# Altium schematic sheet Sheet_BEEE.SchDoc: =DocumentName
size A4; Organization: Polytech; Address4: FRANCE; DocumentNumber: 1; SheetNumber: 1; SheetTotal: 1; Size: A4; SPICEModelCacheGWURXRYI: <root> / <DocumentId>GWURXRYI</DocumentId> / </root>
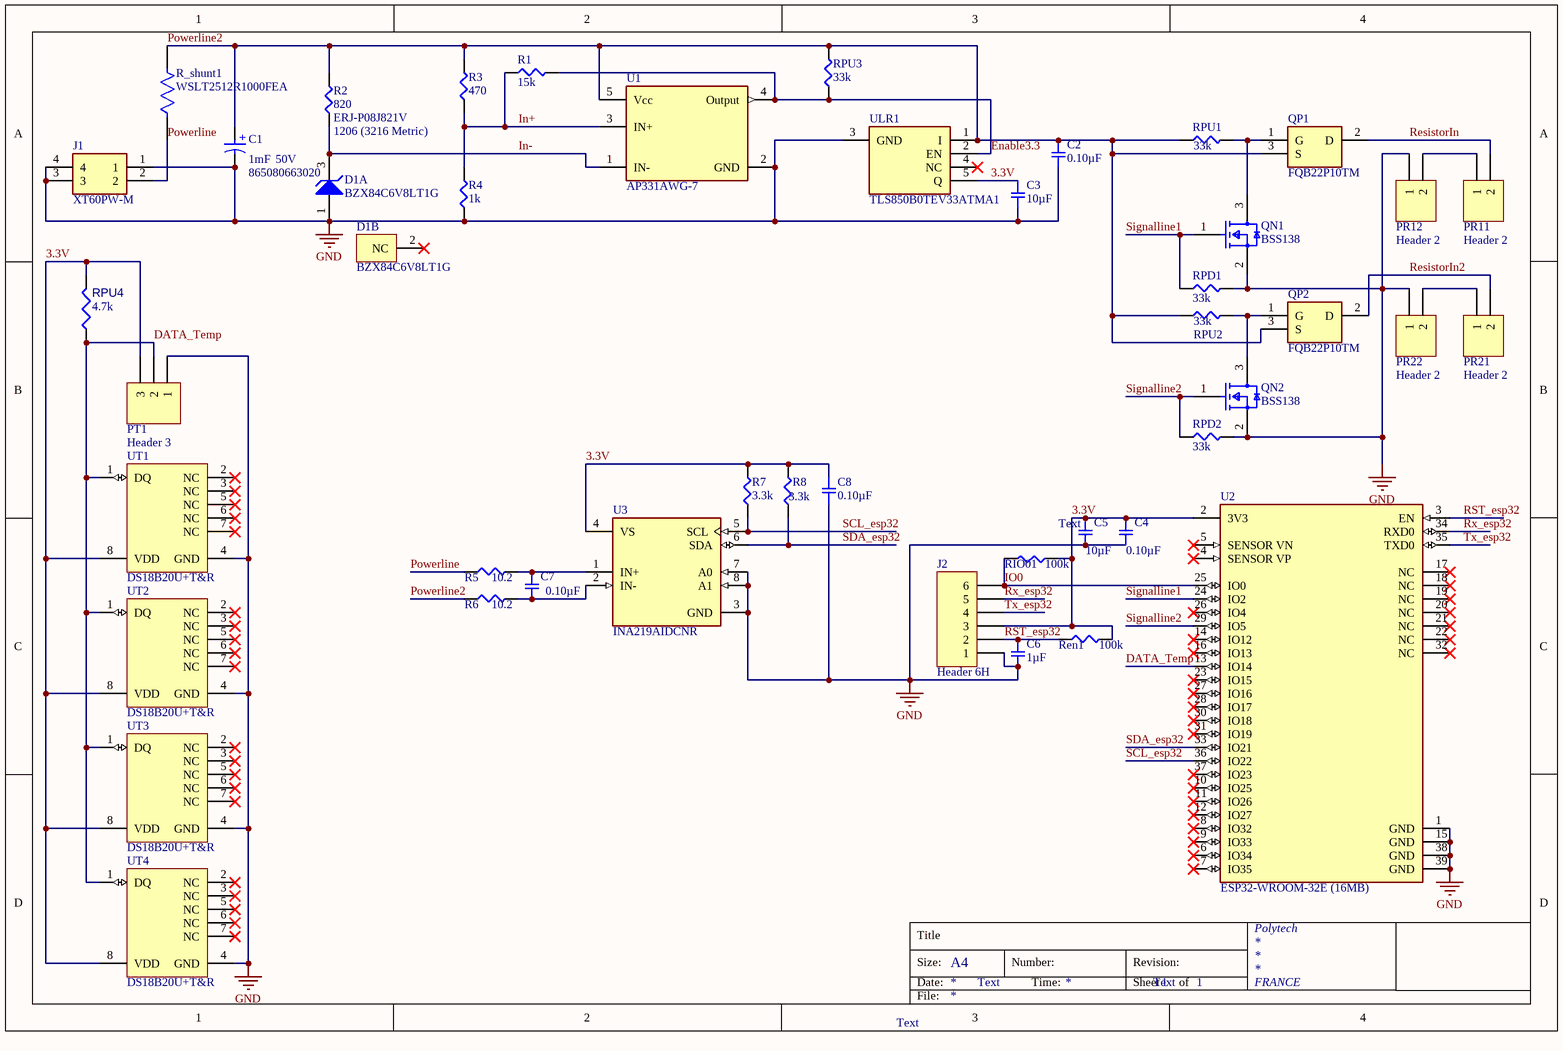
[diagram p0: Sheet_BEEE.SchDoc]

## Parts
C1  865080663020  Capacitance: 1mF  Voltage Rating: 50V  [WCAP-ASLI_D16H17]
C2  value 0.10µF  [SMD-0805C]  (hidden comment: GCM21BR71H104KA37K)
C3  value 10µF  [SMD-0805C]  (hidden comment: GRM21BR6YA106ME43L)
C4  value 0.10µF  [SMD-0805C]  (hidden comment: GCM21BR71H104KA37K)
C5  value 10µF  [SMD-0805C]  (hidden comment: GRM21BR6YA106ME43L)
C6  value 1µF  [SMD-0805C]  (hidden comment: GRJ21BR71H105KE01L)
C7  value 0.10µF  [SMD-0805C]  (hidden comment: GCM21BR71H104KA37K)
C8  value 0.10µF  [SMD-0805C]  (hidden comment: GCM21BR71H104KA37K)
D1  BZX84C6V8LT1G  [ONSC-SOT-23-3-318-08_V]  (parts A,B of 2)
J1  XT60PW-M  [XT60PWM]
J2  Header 6H  [HDR1X6H]
PR11  Header 2  [HDR1X2]
PR12  Header 2  [HDR1X2]
PR21  Header 2  [HDR1X2]
PR22  Header 2  [HDR1X2]
PT1  Header 3  [HDR1X3]
QN1  BSS138  [FP-318-08-IPC_B]
QN2  BSS138  [FP-318-08-IPC_B]
QP1  FQB22P10TM  [FQB22P10TM]
QP2  FQB22P10TM  [FQB22P10TM]
R1  value 15k  [SMD-1206-RES]  (hidden comment: ERJ-P08J153V)
R2  value 820  Package / Case: 1206 (3216 Metric)  [SMD-1206-RES]  (hidden comment: ERJ-P08J821V)
R3  value 470  [SMD-1206-RES]  (hidden comment: ERJ-8ENF4700V)
R4  value 1k  [SMD-1206-RES]  (hidden comment: ERJ-P08J102V)
R5  value 10.2  [SMD-1206-RES]  (hidden comment: ERJ-8ENF10R2V)
R6  value 10.2  [SMD-1206-RES]  (hidden comment: ERJ-8ENF10R2V)
R7  value 3.3k  [SMD-1206-RES]  (hidden comment: ERJ-8GEYJ332V)
R8  value 3.3k  [SMD-1206-RES]  (hidden comment: ERJ-8GEYJ332V)
R_shunt1  WSLT2512R1000FEA  [FP-WSLT2512-MFG]
Ren1  value 100k  [SMD-1206-RES]  (hidden comment: ERJ-P08J104V)
RIO01  value 100k  [SMD-1206-RES]  (hidden comment: ERJ-P08J104V)
RPD1  value 33k  [SMD-1206-RES]  (hidden comment: ERJ-P08J333V)
RPD2  value 33k  [SMD-1206-RES]  (hidden comment: ERJ-P08J333V)
RPU1  value 33k  [SMD-1206-RES]  (hidden comment: ERJ-P08J333V)
RPU2  value 33k  [SMD-1206-RES]  (hidden comment: ERJ-P08J333V)
RPU3  value 33k  [SMD-1206-RES]  (hidden comment: ERJ-P08J333V)
RPU4  value 4.7k  [RESC3116X70X50ML13T20]  (hidden comment: Resistor 4k7 +/-1% 1206 250 mW)
U1  AP331AWG-7  [FP-SOT25-MFG]
U2  ESP32-WROOM-32E (16MB)  [FP-ESP32-WROOM-32E_16MB-MFG]
U3  INA219AIDCNR  [FP-DCN0008A-IPC_B]
ULR1  TLS850B0TEV33ATMA1  [BTS6143D]
UT1  DS18B20U+T&R  [MAXM-U8+1_M]
UT2  DS18B20U+T&R  [MAXM-U8+1_M]
UT3  DS18B20U+T&R  [MAXM-U8+1_M]
UT4  DS18B20U+T&R  [MAXM-U8+1_M]

## Nets
GND: C1.2(N) C2.2 C3.2 C4.2 C5.2 C6.2 C8.1 D1.1(A) J1.1 J1.3 J1.4 J2.1 PR12.1 PR22.1 PT1.1 QN1.2(S) QN2.2(S) R4.1 RPD1.2 RPD2.2 U1.2(GND) U2.1(GND) U2.15(GND) U2.38(GND) U2.39(GND) U3.3(GND) U3.7(A0) U3.8(A1) ULR1.3(GND) UT1.4(GND) UT2.4(GND) UT3.4(GND) UT4.4(GND)
3.3V: C3.1 C4.1 C5.1 C8.2 J2.3 PT1.3 R7.2 R8.2 Ren1.2 RIO01.1 RPU4.2 U2.2(3V3) U3.4(VS) ULR1.5(Q) UT1.8(VDD) UT2.8(VDD) UT3.8(VDD) UT4.8(VDD)
DATA_Temp: PT1.2 RPU4.1 U2.13(IO14) UT1.1(DQ) UT2.1(DQ) UT3.1(DQ) UT4.1(DQ)
Enable3.3: R1.2 RPU3.1 U1.4(Output) ULR1.2(EN)
In+: R1.1 R3.1 R4.2 U1.3(IN+)
In-: D1.3(K) R2.1 U1.1(IN-)
IO0: J2.6 RIO01.2 U2.25(IO0)
Powerline: J1.2 R5.1 R_shunt1.1
Powerline2: C1.1(P) C2.1 QP1.3(S) QP2.3(S) R2.2 R3.2 R6.1 R_shunt1.2 RPU1.1 RPU2.1 RPU3.2 U1.5(Vcc) ULR1.1(I)
ResistorIn: PR11.2 QP1.2(D)
ResistorIn2: PR21.2 QP2.2(D)
RST_esp32: C6.1 J2.2 Ren1.1 U2.3(EN)
Rx_esp32: J2.5 U2.34(RXD0)
SCL_esp32: R7.1 U2.36(IO22) U3.5(SCL)
SDA_esp32: R8.1 U2.33(IO21) U3.6(SDA)
Signalline1: QN1.1(G) RPD1.1 U2.24(IO2)
Signalline2: QN2.1(G) RPD2.1 U2.29(IO5)
Tx_esp32: J2.4 U2.35(TXD0)
NetC7_1: C7.1 R5.2 U3.1(IN+)
NetC7_2: C7.2 R6.2 U3.2(IN-)
NetPR11_1: PR11.1 PR12.2
NetPR21_1: PR21.1 PR22.2
NetQN1_3: QN1.3(D) QP1.1(G) RPU1.2
NetQN2_3: QN2.3(D) QP2.1(G) RPU2.2

Not connected (* = marked no-connect by the designer): D1 2(NC)*; U2 4(SENSOR_VP)* 5(SENSOR_VN)* 6(IO34)* 7(IO35)* 8(IO32)* 9(IO33)* 10(IO25)* 11(IO26)* 12(IO27)* 14(IO12)* 16(IO13)* 17(NC)* 18(NC)* 19(NC)* 20(NC)* 21(NC)* 22(NC)* 23(IO15)* 26(IO4)* 27(IO16)* 28(IO17)* 30(IO18)* 31(IO19)* 32(NC)* 37(IO23)*; ULR1 4(NC)*; UT1 2(NC)* 3(NC)* 5(NC)* 6(NC)* 7(NC)*; UT2 2(NC)* 3(NC)* 5(NC)* 6(NC)* 7(NC)*; UT3 2(NC)* 3(NC)* 5(NC)* 6(NC)* 7(NC)*; UT4 2(NC)* 3(NC)* 5(NC)* 6(NC)* 7(NC)*

## Notes on the sheet
- (near C5) Text
- Text
- Title
- Size:
- Date:
- A4
- Number:
- Time:
- Revision:
- Sheet
- of
- File:
- (in symbol CMP-03913-53914628-1) +

## Library data of the parts
C1 = CMP-03913-53914628-1: 865080663020 WCAP-ASLI Aluminum Electrolytic Capacitors; Ripple Current: 1A; Tolerance: 20%; Life (Hours): 2000hours; ESR (Equivalent Series Resistance): 60.8615mΩ; Leakage Current: 500µA; Insulation Resistance: 100kΩ; Impedance: 78mΩ; Polarity: Polar; RoHS: Compliant; NexarPartId: 53914628; Width: 17.1mm; Height: 17mm; Diameter: 16mm; Mount: Surface Mount; Min Operating Temperature: -55°C; Ripple Current (AC): 1A; Max Operating Temperature: 105°C; Voltage Rating (DC): 50V; REACH SVHC: Unknown; Length: 17mm; Case/Package: Radial; Packaging: Tape & Reel (TR); Height - Seated (Max): 16.9926mm
C2 C4 C7 C8 = CMP-026-000437-1: CAP CER 0.1UF 50V X7R 0805; Manufacturer: Murata Electronics North America; Minimum Quantity: 1; Unit Price (USD): 0.12; Factory Stock: 0; Tolerance: ±10%; Packaging: Cut Tape (CT); Size / Dimension: 0.079" L x 0.049" W (2.00mm x 1.25mm); Lead Style: -; Mounting Type: Surface Mount, MLCC; Operating Temperature: -55°C ~ 125°C; Image: //media.digikey.com/photos/Murata%20Photos/NCP,GCM%20SERIES%200805.jpg; Voltage: 50V; Datasheets: http://www.murata.com/~/media/webrenewal/support/library/catalog/products/capacitor/mlcc/c03e.ashx; Lead Spacing: -; Package / Case: 0805 (2012 Metric); Ratings: AEC-Q200; Features: -; Part Status: Active; Temperature Coefficient: X7R; Part Number: GCM21BR71H104KA37K; Digi-Key Part Number: 490-8049-1-ND; Thickness (Max): 0.055" (1.40mm); Applications: Automotive; Quantity Available: 322; @ qty: 0; Height - Seated (Max): -; Series: GCM
C3 C5 = CMP-026-000648-1: CAP CER 10UF 35V X5R 0805; Manufacturer: Murata Electronics North America; Factory Stock: 0; Unit Price (USD): 0.33; Tolerance: ±20%; Minimum Quantity: 1; Applications: General Purpose; Part Status: Active; Image: //media.digikey.com/Renders/Murata%20Renders/0805%20(2012%20Metric)%20.85mm.jpg; Quantity Available: 79139; Size / Dimension: 0.079" L x 0.049" W (2.00mm x 1.25mm); Datasheets: http://www.murata.com/~/media/webrenewal/support/library/catalog/products/capacitor/mlcc/c02e.pdf; Package / Case: 0805 (2012 Metric); Lead Style: -; Ratings: -; Digi-Key Part Number: 490-10515-1-ND; Height - Seated (Max): -; @ qty: 0; Lead Spacing: -; Part Number: GRM21BR6YA106ME43L; Features: Derating Recommended; Voltage: 35V; Temperature Coefficient: X5R; Operating Temperature: -55°C ~ 85°C; Mounting Type: Surface Mount, MLCC; Packaging: Cut Tape (CT); Thickness (Max): 0.057" (1.45mm); Series: GRM
C6 = CMP-026-000525-1: CAP CER 1UF 50V X7R 0805; Manufacturer: Murata Electronics North America; Factory Stock: 0; Unit Price (USD): 0.26; Tolerance: ±10%; Minimum Quantity: 1; Package / Case: 0805 (2012 Metric); Datasheets: http://www.murata.com/~/media/webrenewal/support/library/catalog/products/capacitor/mlcc/c02e.pdf; Operating Temperature: -55°C ~ 125°C; Size / Dimension: 0.079" L x 0.049" W (2.00mm x 1.25mm); Image: //media.digikey.com/Renders/Murata%20Renders/0805%20(2012%20Metric)%20.85mm.jpg; Packaging: Cut Tape (CT); Ratings: -; Digi-Key Part Number: 490-10924-1-ND; Quantity Available: 2092; Mounting Type: Surface Mount, MLCC; Height - Seated (Max): -; Series: GRJ; Part Number: GRJ21BR71H105KE01L; Thickness (Max): 0.057" (1.45mm); Applications: Boardflex Sensitive; Part Status: Active; Lead Spacing: -; Features: Soft Termination; Temperature Coefficient: X7R; Lead Style: -; Voltage: 50V; @ qty: 0
D1 = CMP-1060-00902-1: Zener Voltage Regulator, 225 mW, 3-Pin SOT-23, Pb-Free, Tape and Reel; Manufacturer: On Semiconductor; ComponentLink2Description: Datasheet; RoHS: Pb-Free; ComponentLink2URL: http://www.onsemi.com/pub_link/Collateral/BZX84C2V4LT1-D.PDF; ComponentLink1Description: Manufacturer URL; ComponentLink3URL: http://www.onsemi.cn/pub_link/Collateral/318-08.PDF; PartNumber: BZX84C6V8LT1G; ComponentLink1URL: http://www.onsemi.com/; Mounting Technology: Surface Mount; PackageDescription: 3-Pin Small Outline Transistor, Body 2.92 x 1.3 mm, Pitch 0.95 mm; Packing: Tape and Reel; ComponentLink3Description: Package Specification; PackageReference: SOT-23-3-318-08; PackageVersion: Rev. AP, 11/2009; DatasheetVersion: Rev. 17
J1 = XT60PW-M: Connector; Manufacturer_Name: Changzou Amass Elec; Datasheet Link: https://www.tme.eu/Document/9b8d0c5eb7094295f3d3112c214d3ade/XT60PW%20SPEC.pdf; Height: 8.4mm; Manufacturer_Part_Number: XT60PW-M
J2 = Header 6H: Header, 6-Pin, Right Angle; LatestRevisionDate: 17-Jul-2002; LatestRevisionNote: Re-released for DXP Platform.; Publisher: Altium Limited; Supplier 1: Rs; Supplier Part Number 1: 8281660
PR11 PR12 PR21 PR22 = Header 2: Header, 2-Pin; LatestRevisionDate: 17-Jul-2002; LatestRevisionNote: Re-released for DXP Platform.; Publisher: Altium Limited
PT1 = Header 3: Header, 3-Pin; LatestRevisionDate: 17-Jul-2002; LatestRevisionNote: Re-released for DXP Platform.; Publisher: Altium Limited
QN1 QN2 = CMP-07173-000101-1: MOSFET N-CH 50V 220MA SOT-23; Turn-Off Delay Time: 20ns; Element Configuration: Single; Rds On Max: 3.5R; Gate to Source Voltage (Vgs): 20V; Threshold Voltage: 1.3V; Number of Elements: 1; Power Dissipation: 360mW; Rise Time: 9ns; Turn-On Delay Time: 2.5ns; Input Capacitance: 27pF; On-State Resistance: 6R; Lead Free: Lead Free; Length: 2.92mm; Width: 1.3mm; Drain to Source Breakdown Voltage: 50V; Min Operating Temperature: -55°C; REACH SVHC: No SVHC; Packaging: Tape and Reel; Radiation Hardening: No; Height: 0.93mm; Drain to Source Voltage (Vdss): 50V; Current Rating: 220mA; Voltage Rating (DC): 50V; Weight: 0.03g; Continuous Drain Current (ID): 220mA; Number of Pins: 3; Nominal Vgs: 1.3V; Max Power Dissipation: 360mW; Fall Time: 9ns; Drain to Source Resistance: 3.5R; Contact Plating: Tin; Case/Package: SOT-23; Package Quantity: 1; Dual Supply Voltage: 50V; Mount: Surface Mount; Termination: SMD/SMT; Max Operating Temperature: 150°C
QP1 QP2 = FQB22P10TM: MOSFET (P-Channel); Manufacturer_Name: onsemi; Datasheet Link: https://www.onsemi.cn/download/data-sheet/pdf/fqb22p10-d.pdf; Height: 5.08mm; Manufacturer_Part_Number: FQB22P10TM; Mouser Part Number: 512-FQB22P10TM; Mouser Price/Stock: https://www.mouser.co.uk/ProductDetail/ON-Semiconductor-Fairchild/FQB22P10TM?qs=u3sZpSG73%252B7bL0dxrg7qrg%3D%3D; Arrow Part Number: FQB22P10TM; Arrow Price/Stock: https://www.arrow.com/en/products/fqb22p10tm/on-semiconductor?region=europe
R1 = CMP-015-001045-1: RES SMD 15K OHM 5% 2/3W 1206; Manufacturer: Panasonic Electronic Components; Factory Stock: 0; Temperature Coefficient: ±200ppm/°C; Minimum Quantity: 1; Power (Watts): 0.667W, 2/3W; Unit Price (USD): 0.02178; @ qty: 1500; Tolerance: ±5%; Supplier Device Package: 1206; Datasheets: https://industrial.panasonic.com/cdbs/www-data/pdf/RDA0000/AOA0000C243.pdf; Features: Automotive AEC-Q200, Pulse Withstanding; Failure Rate: -; Part Number: ERJ-P08J153V; Image: //media.digikey.com/Renders/Panasonic%20Renders/ERJ-1206%20Pkg.jpg; Part Status: Active; Height - Seated (Max): 0.028" (0.70mm); Composition: Thick Film; Quantity Available: 10955; Packaging: Cut Tape (CT); Number of Terminations: 2; Series: ERJ; Package / Case: 1206 (3216 Metric); Digi-Key Part Number: P15KALCT-ND; Operating Temperature: -55°C ~ 155°C; Size / Dimension: 0.126" L x 0.063" W (3.20mm x 1.60mm)
R2 = CMP-015-001133-1: RES SMD 820 OHM 5% 2/3W 1206; Manufacturer: Panasonic Electronic Components; Power (Watts): 0.667W, 2/3W; @ qty: 1500; Unit Price (USD): 0.02178; Temperature Coefficient: ±200ppm/°C; Factory Stock: 0; Minimum Quantity: 1; Operating Temperature: -55°C ~ 155°C; Part Status: Active; Digi-Key Part Number: P820ALCT-ND; Series: ERJ; Supplier Device Package: 1206; Features: Automotive AEC-Q200, Pulse Withstanding; Tolerance: ±5%; Failure Rate: -; Image: //media.digikey.com/Renders/Panasonic%20Renders/ERJ-1206%20Pkg.jpg; Quantity Available: 13581; Composition: Thick Film; Packaging: Cut Tape (CT); Size / Dimension: 0.126" L x 0.063" W (3.20mm x 1.60mm); Part Number: ERJ-P08J821V; Datasheets: https://industrial.panasonic.com/cdbs/www-data/pdf/RDA0000/AOA0000C243.pdf; Number of Terminations: 2; Height - Seated (Max): 0.028" (0.70mm)
R3 = CMP-015-000572-1: RES SMD 470 OHM 1% 1/4W 1206; Manufacturer: Panasonic Electronic Components; Power (Watts): 0.25W, 1/4W; Minimum Quantity: 1; Unit Price (USD): 0.00933; Factory Stock: 0; @ qty: 1500; Temperature Coefficient: ±100ppm/°C; Package / Case: 1206 (3216 Metric); Part Number: ERJ-8ENF4700V; Failure Rate: -; Size / Dimension: 0.126" L x 0.063" W (3.20mm x 1.60mm); Tolerance: ±1%; Part Status: Active; Datasheets: http://industrial.panasonic.com/www-cgi/jvcr13pz.cgi?E+PZ+3+AOA0002+ERJ8ENF4700V+7+WW; Image: //media.digikey.com/Renders/Panasonic%20Renders/ERJ-1206%20Pkg.jpg; Quantity Available: 55045; Packaging: Cut Tape (CT); Supplier Device Package: 1206; Series: ERJ; Operating Temperature: -55°C ~ 155°C; Features: Automotive AEC-Q200; Composition: Thick Film; Height - Seated (Max): 0.028" (0.70mm); Digi-Key Part Number: P470FCT-ND; Number of Terminations: 2
R4 = CMP-015-001023-1: RES SMD 1K OHM 5% 2/3W 1206; Manufacturer: Panasonic Electronic Components; Temperature Coefficient: ±200ppm/°C; Minimum Quantity: 1; Factory Stock: 0; Unit Price (USD): 0.02178; @ qty: 1500; Power (Watts): 0.667W, 2/3W; Tolerance: ±5%; Composition: Thick Film; Height - Seated (Max): 0.028" (0.70mm); Quantity Available: 85126; Supplier Device Package: 1206; Datasheets: https://industrial.panasonic.com/cdbs/www-data/pdf/RDA0000/AOA0000C243.pdf; Series: ERJ; Part Number: ERJ-P08J102V; Package / Case: 1206 (3216 Metric); Image: //media.digikey.com/Renders/Panasonic%20Renders/ERJ-1206%20Pkg.jpg; Failure Rate: -; Packaging: Cut Tape (CT); Features: Automotive AEC-Q200, Pulse Withstanding; Operating Temperature: -55°C ~ 155°C; Part Status: Active; Digi-Key Part Number: P1.0KALCT-ND; Number of Terminations: 2; Size / Dimension: 0.126" L x 0.063" W (3.20mm x 1.60mm)
R5 R6 = CMP-015-000202-1: RES SMD 10.2 OHM 1% 1/4W 1206; Manufacturer: Panasonic Electronic Components; Minimum Quantity: 1; Unit Price (USD): 0.00933; Power (Watts): 0.25W, 1/4W; Factory Stock: 0; Temperature Coefficient: ±100ppm/°C; @ qty: 1500; Supplier Device Package: 1206; Features: Automotive AEC-Q200; Operating Temperature: -55°C ~ 155°C; Packaging: Cut Tape (CT); Series: ERJ; Size / Dimension: 0.126" L x 0.063" W (3.20mm x 1.60mm); Failure Rate: -; Tolerance: ±1%; Height - Seated (Max): 0.028" (0.70mm); Part Number: ERJ-8ENF10R2V; Digi-Key Part Number: P10.2FCT-ND; Part Status: Active; Image: //media.digikey.com/Renders/Panasonic%20Renders/ERJ-1206%20Pkg.jpg; Package / Case: 1206 (3216 Metric); Composition: Thick Film; Quantity Available: 19753; Datasheets: http://industrial.panasonic.com/www-cgi/jvcr13pz.cgi?E+PZ+3+AOA0002+ERJ8ENF10R2V+7+WW; Number of Terminations: 2
R7 R8 = CMP-015-000849-1: RES SMD 3.3K OHM 5% 1/4W 1206; Manufacturer: Panasonic Electronic Components; Factory Stock: 0; @ qty: 1500; Unit Price (USD): 0.00700; Minimum Quantity: 1; Power (Watts): 0.25W, 1/4W; Temperature Coefficient: ±200ppm/°C; Failure Rate: -; Quantity Available: 426004; Height - Seated (Max): 0.028" (0.70mm); Package / Case: 1206 (3216 Metric); Number of Terminations: 2; Tolerance: ±5%; Image: //media.digikey.com/Renders/Panasonic%20Renders/ERJ-1206%20Pkg.jpg; Supplier Device Package: 1206; Datasheets: http://industrial.panasonic.com/www-cgi/jvcr13pz.cgi?E+PZ+3+AOA0001+ERJ8GEYJ332V+7+WW; Part Status: Active; Operating Temperature: -55°C ~ 155°C; Series: ERJ; Size / Dimension: 0.126" L x 0.063" W (3.20mm x 1.60mm); Digi-Key Part Number: P3.3KECT-ND; Packaging: Cut Tape (CT); Composition: Thick Film; Features: Automotive AEC-Q200; Part Number: ERJ-8GEYJ332V
R_shunt1 = CMP-00030-44432532-1: WSLT2512R1000FEA Res Metal Strip 2512 0.1 Ohm 1% 1W ±75ppm/C Pad SMD Automotive T/R; Resistance: 100mΩ; Temperature Coefficient: 75ppm/°C; REACH SVHC: Unknown; Height: 635µm; Power Rating: 1W; Case Code (Metric): 6432; Weight: 40.511469mg; Radiation Hardening: No; Mount: Surface Mount; Case/Package: 2512; Termination: SMD/SMT; Max Operating Temperature: 275°C; Width: 3.2mm; Min Operating Temperature: -65°C; Lead Free: Lead Free; Depth: 3.18mm; Schedule B: 8533210045, 8533210045; Composition: Metal Element, Metal Strip; Packaging: Cut Tape; Case Code (Imperial): 2512; NexarPartId: 44432532; Tolerance: 1%; RoHS: Compliant; Length: 6.3mm
Ren1 RIO01 = CMP-015-001025-1: RES SMD 100K OHM 5% 2/3W 1206; Manufacturer: Panasonic Electronic Components; Temperature Coefficient: ±200ppm/°C; @ qty: 1500; Power (Watts): 0.667W, 2/3W; Minimum Quantity: 1; Factory Stock: 0; Unit Price (USD): 0.02178; Digi-Key Part Number: P100KALCT-ND; Failure Rate: -; Number of Terminations: 2; Package / Case: 1206 (3216 Metric); Datasheets: https://industrial.panasonic.com/cdbs/www-data/pdf/RDA0000/AOA0000C243.pdf; Part Number: ERJ-P08J104V; Series: ERJ; Height - Seated (Max): 0.028" (0.70mm); Size / Dimension: 0.126" L x 0.063" W (3.20mm x 1.60mm); Tolerance: ±5%; Operating Temperature: -55°C ~ 155°C; Features: Automotive AEC-Q200, Pulse Withstanding; Supplier Device Package: 1206; Composition: Thick Film; Part Status: Active; Packaging: Cut Tape (CT); Image: //media.digikey.com/Renders/Panasonic%20Renders/ERJ-1206%20Pkg.jpg; Quantity Available: 9
RPD1 RPD2 RPU1-RPU3 = CMP-015-001084-1: RES SMD 33K OHM 5% 2/3W 1206; Manufacturer: Panasonic Electronic Components; Power (Watts): 0.667W, 2/3W; Factory Stock: 0; Minimum Quantity: 1; @ qty: 1500; Unit Price (USD): 0.02178; Temperature Coefficient: ±200ppm/°C; Quantity Available: 25960; Composition: Thick Film; Size / Dimension: 0.126" L x 0.063" W (3.20mm x 1.60mm); Series: ERJ; Package / Case: 1206 (3216 Metric); Tolerance: ±5%; Packaging: Cut Tape (CT); Failure Rate: -; Part Number: ERJ-P08J333V; Features: Automotive AEC-Q200, Pulse Withstanding; Supplier Device Package: 1206; Operating Temperature: -55°C ~ 155°C; Datasheets: https://industrial.panasonic.com/cdbs/www-data/pdf/RDA0000/AOA0000C243.pdf; Part Status: Active; Number of Terminations: 2; Digi-Key Part Number: P33KALCT-ND; Image: //media.digikey.com/Renders/Panasonic%20Renders/ERJ-1206%20Pkg.jpg; Height - Seated (Max): 0.028" (0.70mm)
RPU4 = CMP-009-00033-5: Chip Resistor, 4.7 KOhm, +/- 1%, 0.25 W, -55 to 155 degC, 1206 (3216 Metric); Power: 250mW; Voltage Rating: 200V; Pins: 2; Min Operating Temperature: -55°C; Max Operating Temperature: 155°C; Case/Package: 1206; Tolerance: 1%; RoHS Compliant: True; Mounting Technology: SM
U1 = CMP-12735-000001-1: IC COMPARATOR SGL DIFF SOT-25; Manufacturer: Diodes Inc.; Standoff Height: 0.013mm; Min Dual Supply Voltage: 1V; Input Offset Voltage: 4mV; Min Supply Voltage: 2V; Output Current Per Channel: 16mA; Number Of Channels: 1; Voltage Gain: 200V/mV; Max Supply Voltage: 36V; Input Bias Current: 0.15uA; Max Junction Temp: +150°C; Nominal Supply Current: 0.4-1mA; Max Dual Supply Voltage: 18V; Response Time: 300ns; Category: IC; Temperature Range High: +70°C; Automotive: No; Lead Free: Yes; Digikey Description: IC COMPARATOR SGL DIFF SOT-25; Ambient Temperature Range Low: 0°C; Octopart: https://octopart.com/ap331awg-7-diodes+inc.-12688108; Manufacturer Part Number: AP331AWG-7; Device Class L2: Linear ICs; RoHS: TRUE; Package: SOT25; ComponentLink2Description: Datasheet; Temperature: 0°C to +70°C; Height: 1.4mm; Device Class L3: Comparators; Temperature Range Low: 0°C; ComponentLink2URL: https://www.diodes.com/assets/Datasheets/AP331A.pdf; Device Class L1: Integrated Circuits (ICs); Mouser Description: Analog Comparators 2V-36V 2.5mA 2V-36V 2.5mA; Ambient Temperature Range High: +70°C; Footprint Url: https://www.diodes.com/assets/Package-Files/SOT25.pdf
U2 = CMP-194065-000027-1: RX TXRX MOD WIFI TRACE ANT SMD
U3 = CMP-0704-00041-3: IC CURRENT MONITOR 1% SOT23-8; Common Mode Rejection Ratio: 100dB; Bandwidth: 3.4MHz; Operating Supply Current: 1mA; Nominal Supply Current: 700uA; Min Input Voltage: 0V; Output Current per Channel: 10mA; Number of Amplifiers: 1; Input Offset Voltage (Vos): 100uV; Max Input Voltage: 26V; Min Supply Voltage: 3V; Max Supply Current: 5mA; Max Supply Voltage: 5.5V; Output Type: Digital; Accuracy: 1%; Radiation Hardening: No; Min Operating Temperature: -40°C; Contact Plating: Gold; REACH SVHC: No SVHC; Packaging: Tape and Reel; Max Operating Temperature: 125°C; Lead Free: Lead Free; Weight: 0.001411oz; Supply Current: 700uA; Number of Pins: 8; Length: 3mm; Quiescent Current: 700uA; Features: I²C; Height: 1.3mm; Output Current: 10mA; Case/Package: SOT-23-8; RoHS Compliant: Yes; Width: 1.75mm; Package Quantity: 3000; Series: Zero-Drift
ULR1 = TLS850B0TEV33ATMA1: Integrated Circuit; Manufacturer_Name: Infineon; Datasheet Link: https://componentsearchengine.com/Datasheets/1/TLS850B0TEV33ATMA1.pdf; Height: 2mm; Manufacturer_Part_Number: TLS850B0TEV33ATMA1; Mouser Part Number: 726-TLS850B0TEV33ATM; Mouser Price/Stock: https://www.mouser.co.uk/ProductDetail/Infineon-Technologies/TLS850B0TEV33ATMA1?qs=W0yvOO0ixfGvA2FkIMPoCw%3D%3D; Arrow Part Number: TLS850B0TEV33ATMA1; Arrow Price/Stock: https://www.arrow.com/en/products/tls850b0tev33atma1/infineon-technologies-ag?region=nac
UT1-UT4 = CMP-0253-00024-2: High-Precision 1-Wire Digital Thermometer, -55 to 125 degC, 8-Pin SOP (U8+1), Pb-Free, Tape and Reel; Temp. Thresh.: Programmable (NV); Multi Droppable: Yes; Sensor Type: Local; RoHS: Pb-Free; ComponentLink1Description: Manufacturer URL; PackageReference: U8+1; PackageVersion: Rev. L, 08/2009; DatasheetVersion: Rev. 4; Packing: Tape and Reel; Interface: 1-Wire; ComponentLink3URL: http://pdfserv.maximintegrated.com/package_dwgs/21-0036.PDF; ComponentLink2URL: http://datasheets.maximintegrated.com/en/ds/DS18B20.pdf; Generic Part Number: DS18B20; ComponentLink3Description: Package Specification; ComponentLink2Description: Datasheet; PackageDescription: 8-Pin Micro-MAX, Thin Shrink Small-Outline (U8+1), Body 3 x 3 mm, Pitch 0.65 mm; Code_JEDEC: MO-187; PartNumber: DS18B20U+T&R; ComponentLink1URL: http://www.maximintegrated.com/; Parasite Pwr.: Yes; Mounting Technology: Surface Mount